# EAGLE design relay (EAGLE 6.5.0)
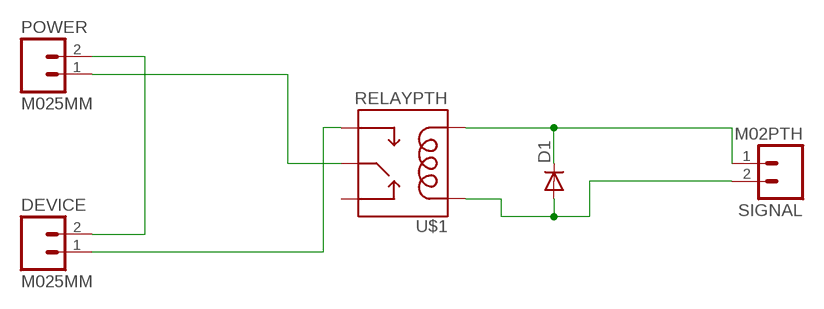
[diagram p0: schematic, sheet 1]

## Parts
D1  DIODE1N4148  [DIODE-1N4148]
DEVICE  M025MM  [SCREWTERMINAL-5MM-2]
POWER  M025MM  [SCREWTERMINAL-5MM-2]
SIGNAL  M02PTH  [1X02]
U$1  RELAYPTH  [RELAY-G5Q]

## Nets
N$3: D1.C SIGNAL.1 U$1.1(COIL2)
N$4 [gnd]: D1.A SIGNAL.2 U$1.5(COIL1)
N$7: POWER.1 U$1.2(MAIN)
N$8: DEVICE.1 U$1.3(NO)
N$9: DEVICE.2 POWER.2
Unconnected: U$1.4(NC)

## Library data of the parts
D1 = SparkFun-DiscreteSemi:DIODE: Diode These are standard reverse protection diodes and small signal diodes. SMA package can handle up to about 1A. SOD-323 can handle about 200mA. What the SOD-323 package when ordering, there are some mfgs out there that are 5-pin packages.
DEVICE POWER SIGNAL = SparkFun-Connectors:M02: Standard 2-pin 0.1" header. Use with - straight break away headers ( PRT-00116) - right angle break away headers (PRT-00553) - swiss pins (PRT-00743) - machine pins (PRT-00117) - female headers (PRT-00115) Molex polarized connector foot print use with: PRT-08233 with associated crimp pins and housings. 2.54_SCREWTERM for use with PRT-10571. 3.5mm Screw Terminal footprints for PRT-08084 5mm Screw Terminal footprints for use with PRT-08433
U$1 = SparkFun-Electromechanical:RELAY: SPDT relay (COM-00101)

## Net classes
0 default: width 0.152 mm, clearance 0.152 mm
1 power: width 0.61 mm, drill 0.61 mm, clearance 0.254 mm
2 gnd: width 0.203 mm, drill 0.559 mm, clearance 0.152 mm
3 usbvcc: width 0.203 mm, drill 0.61 mm, clearance 0.152 mm
4 aref: width 0.406 mm, drill 0.61 mm, clearance 0.254 mm

## Board
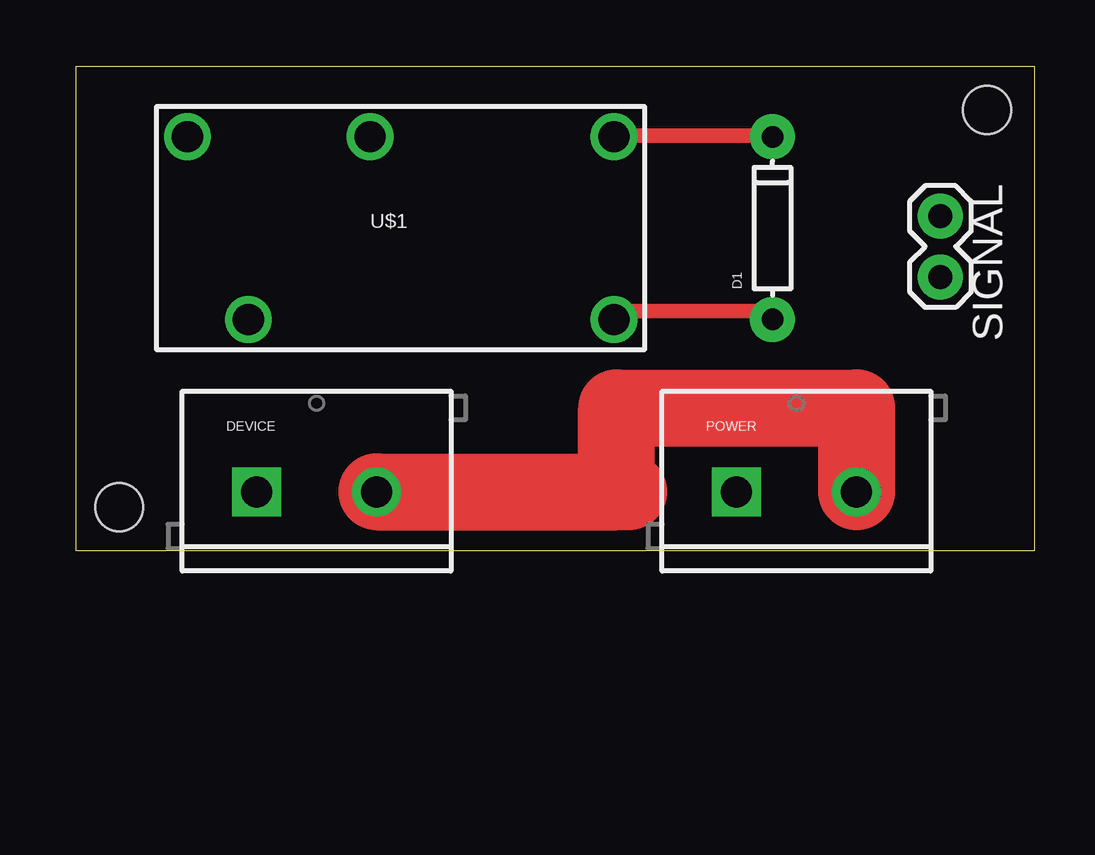
[diagram p1: board, top side]
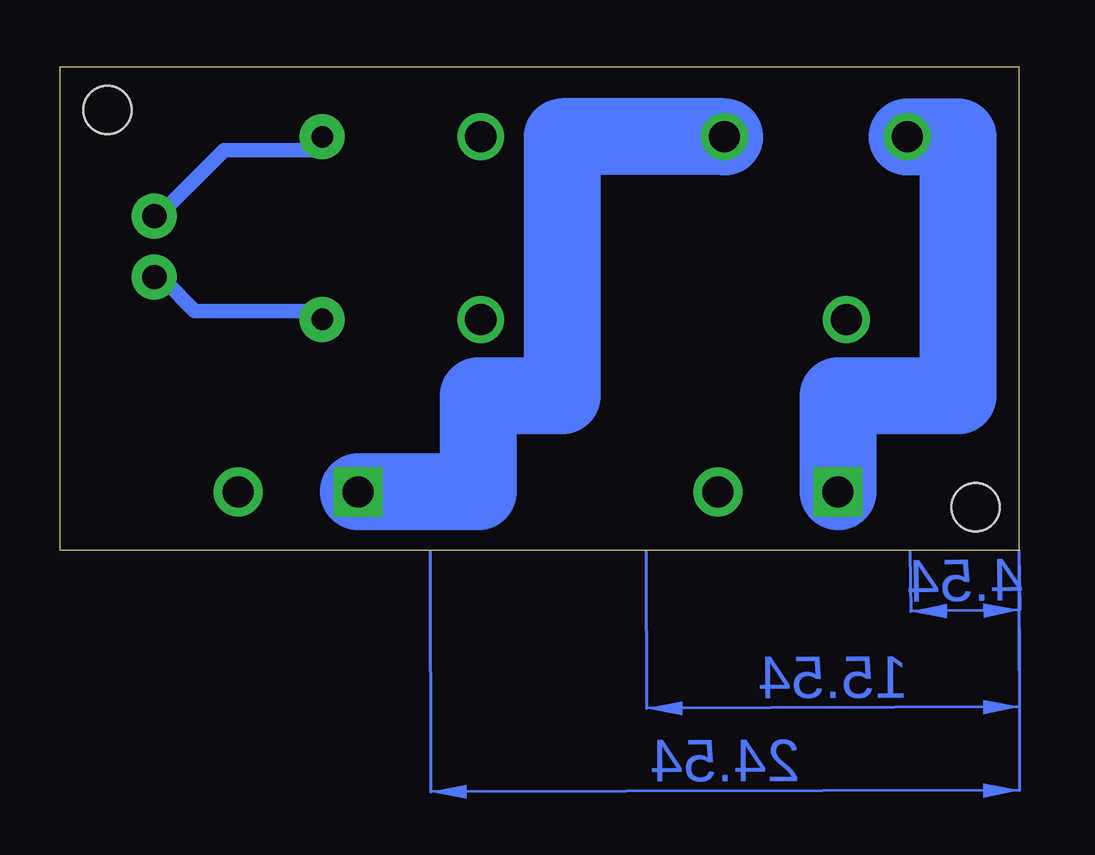
[diagram p2: board, bottom side, seen from below]

Size 39.97 x 20.17 mm. Coordinates in mm from the lower left corner, seen from the top.
Outline: 0,0 39.97,0 39.97,20.17 0,20.17 0,0
Copper layers (1*16): Top 0.035mm / dielectric 1.5mm / Bottom 0.035mm
Design rules "default *": minimum track width 24mil, minimum drill 24mil, track to track 10mil, track to pad 8mil, pad to pad 8mil, via to via 8mil, smd to smd 8mil, copper to edge 40mil, drill to drill 8mil, minimum pad ring 10mil, minimum via ring 8mil, stop-mask expansion 4mil, vias tented up to drill 0mil, thermal gap 10mil
Holes 2 mm at 37.99,18.37 1.81,1.81

### Footprints (pad centres in the part's own frame; a part is rotated, then mirrored left to right if it is on the bottom)
DIODE-1N4148 = drill 0.9 pad 1.88: A -3.81,0; C 3.81,0
SCREWTERMINAL-5MM-2 = drill 1.3 pad 2.032 square: 1 0,0 | drill 1.3 pad 2.032: 2 5,0
1X02 = drill 1.016 pad 1.88: 1 0,0; 2 2.54,0
RELAY-G5Q = drill 1.3: 1 8.89,3.81; 2 -1.27,3.81; 3 -8.89,3.81; 4 -6.35,-3.81; 5 8.89,-3.81

### Placement (x,y rotation side)
D1  29.04,13.44 90 top
DEVICE  7.54,2.44 0 top
POWER  27.54,2.44 0 top
SIGNAL  36.04,13.94 270 top
U$1  13.54,13.44 0 top

### Tracks (layer width: path | path; a pad name or v marks a point on that pad's centre or on a via)
N$3
  Top 0.61: D1.C 28.86,17.3 22.77,17.3 U$1.1
  Bottom 0.61: SIGNAL.1 35.57,14.26 33.13,16.69 29.47,16.69 D1.C
N$4
  Top 0.61: D1.A 28.86,9.99 22.77,9.99 U$1.5
  Bottom 0.61: SIGNAL.2 35.57,11.21 34.35,9.99 29.47,9.99 D1.A
N$7
  Bottom 3.2: U$1.2 19.04,17.25 19.04,6.44 22.54,6.44 22.54,2.44 POWER.1
N$8
  Bottom 3.2: U$1.3 2.54,17.25 2.54,6.44 7.54,6.44 DEVICE.1
N$9
  Top 3.2: DEVICE.2 22.54,2.44 | 23.04,2.44 22.54,2.44 | 22.54,2.44 22.54,5.94 32.54,5.94 POWER.2
(copper drawn outside any net)
  shapes: Bottom area x3